# EAGLE schematic MPC_IR_Blaster (EAGLE 5.11)
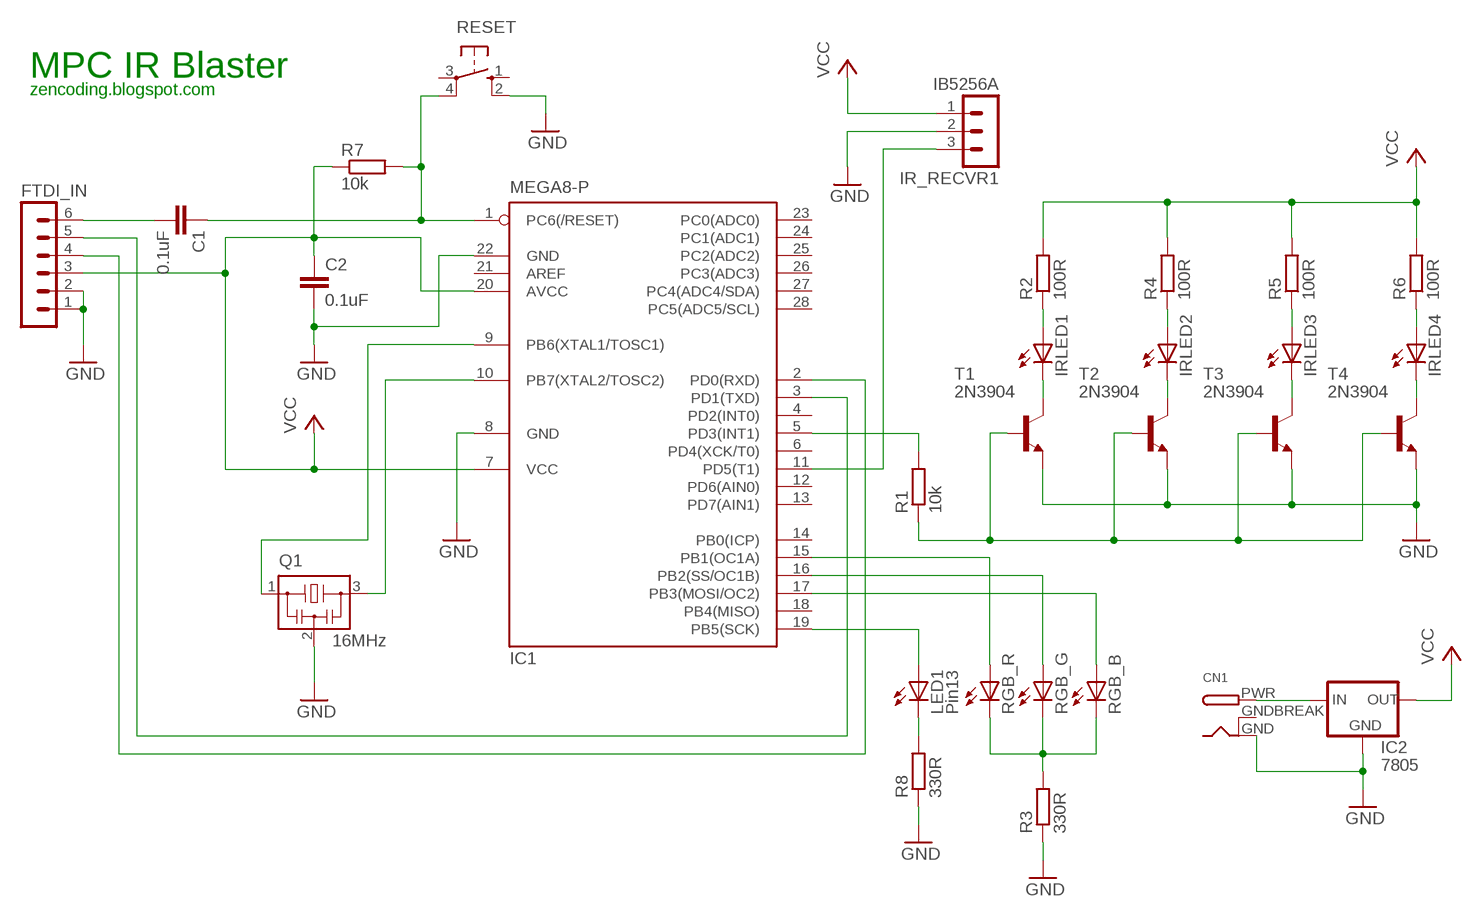
[diagram p0: schematic, sheet 1]

## Parts
C1  0.1uF  C-EU025-025X050  [C025-025X050]
C2  0.1uF  C-EU025-025X050  [C025-025X050]
CN1  DCBARRELPTH  [DCJACK_2MM_PTH]
FTDI_IN  MA06-1  [MA06-1]
IC1  MEGA8-P  [DIL28-3]
IC2  7805  78XXL  [78XXL]
IR_RECVR1  IB5256A  MA03-1  [MA03-1]
IRLED1  LED5MM  [LED5MM]
IRLED2  LED5MM  [LED5MM]
IRLED3  LED5MM  [LED5MM]
IRLED4  LED5MM  [LED5MM]
LED1  Pin13  LED3MM  [LED3MM]
Q1  16MHz  CSTCR6M00G53Z  [CSTCR6M]
R1  10k  R-EU_0204/5  [0204/5]
R2  100R  R-EU_0204/5  [0204/5]
R3  330R  R-EU_0204/5  [0204/5]
R4  100R  R-EU_0204/5  [0204/5]
R5  100R  R-EU_0204/5  [0204/5]
R6  100R  R-EU_0204/5  [0204/5]
R7  10k  R-EU_0204/5  [0204/5]
R8  330R  R-EU_0204/5  [0204/5]
RESET  10-XX  [B3F-10XX]
RGB_B  LED5MM  [LED5MM]
RGB_G  LED5MM  [LED5MM]
RGB_R  LED5MM  [LED5MM]
T1  2N3904  [TO92]
T2  2N3904  [TO92]
T3  2N3904  [TO92]
T4  2N3904  [TO92]

## Nets
DIGI_10: C1.1 IC1.1(PC6(/RESET)) R7.2 RESET.4(P1)
GND: C2.2 CN1.GND FTDI_IN.1 FTDI_IN.2 IC1.8(GND) IC1.22(GND) IC2.GND IR_RECVR1.2 Q1.2 R3.1 R8.1 RESET.2(S1) T1.3(E) T2.3(E) T3.3(E) T4.3(E)
N$1: IRLED1.A R2.1
N$2: IRLED1.K(C) T1.1(C)
N$3: R1.1 T1.2(B) T2.2(B) T3.2(B) T4.2(B)
N$4: R3.2 RGB_B.K(C) RGB_G.K(C) RGB_R.K(C)
N$5: IRLED2.A R4.1
N$6: IRLED2.K(C) T2.1(C)
N$7: IRLED3.A R5.1
N$8: IRLED3.K(C) T3.1(C)
N$9: IRLED4.A R6.1
N$10: IRLED4.K(C) T4.1(C)
N$11: C1.2 FTDI_IN.6
N$12: IC1.10(PB7(XTAL2/TOSC2)) Q1.3
N$13: IC1.9(PB6(XTAL1/TOSC1)) Q1.1
N$14: FTDI_IN.4 IC1.2(PD0(RXD))
N$15: FTDI_IN.5 IC1.3(PD1(TXD))
N$16: IC1.19(PB5(SCK)) LED1.A
N$17: LED1.K(C) R8.2
N$18: IC1.15(PB1(OC1A)) RGB_R.A
N$19: CN1.PWR IC2.IN
PIN3: IC1.5(PD3(INT1)) R1.2
PIN5: IR_RECVR1.3
PIN10: RGB_G.A
PIN11: RGB_B.A
VCC: C2.1 FTDI_IN.3 IC1.7(VCC) IC1.20(AVCC) IC2.OUT IR_RECVR1.1 R2.2 R4.2 R5.2 R6.2 R7.1
Unconnected: IC1.4(PD2(INT0)) IC1.6(PD4(XCK/T0)) IC1.11(PD5(T1)) IC1.12(PD6(AIN0)) IC1.13(PD7(AIN1)) IC1.14(PB0(ICP)) IC1.16(PB2(SS/OC1B)) IC1.17(PB3(MOSI/OC2)) IC1.18(PB4(MISO)) IC1.21(AREF) IC1.23(PC0(ADC0)) IC1.24(PC1(ADC1)) IC1.25(PC2(ADC2)) IC1.26(PC3(ADC3)) IC1.27(PC4(ADC4/SDA)) IC1.28(PC5(ADC5/SCL)) RESET.1(S) RESET.3(P)

## Notes on the sheet
- MPC IR Blaster
- zencoding.blogspot.com

## Power pins joined to a net without a drawn wire
GNDBREAK: CN1.GNDBREAK

## Library data of the parts
C1 = rcl:C-EU: CAPACITOR, European symbol
C2 = resistor:C-EU: CAPACITOR, European symbol
CN1 = adafruit:DCBARREL: 2.0mm DC Barrel Jack DCJACK_2MM_PTH - Through Hole Jack (4UConnector: 05537)
FTDI_IN = con-lstb:MA06-1: PIN HEADER; OC_FARNELL: unknown; OC_NEWARK: unknown
IC1 = atmel:MEGA8-P: MICROCONTROLLER 8 Kbytes FLASH, 1 kbytes SRAM, 512 bytes EEPROM, USART, 4-channel 10 bit ADC, 2-channel 8 bit ADC Pin compatible with Atmega48, ATMega88, ATMega168 Source: avr.lbr; OC_FARNELL: unknown; OC_NEWARK: unknown
IC2 = v-reg:78XXL: VOLTAGE REGULATOR
IR_RECVR1 = con-lstb:MA03-1: PIN HEADER; OC_FARNELL: unknown; OC_NEWARK: unknown
IRLED1-IRLED4 LED1 RGB_B RGB_G RGB_R = led:LED: LED OSRAM: - CHIPLED LG R971, LG N971, LY N971, LG Q971, LY Q971, LO R971, LY R971 LH N974, LH R974 LS Q976, LO Q976, LY Q976 LO Q996 - Hyper CHIPLED LW Q18S LB Q993, LB Q99A, LB R99A - SideLED LS A670, LO A670, LY A670, LG A670, LP A670 LB A673, LV A673, LT A673, LW A673 LH A674 LY A675 LS A676, LA A676, LO A676, LY A676, LW A676 LS A679, LY A679, LG A679 - Hyper Micro SIDELED® LS Y876, LA Y876, LO Y876, LY Y876 LT Y87S - SmartLED LW L88C, LW L88S LB L89C, LB L89S, LG L890 LS L89K, LO L89K, LY L89K LS L896, LA L896, LO L896, LY L896 - TOPLED LS T670, LO T670, LY T670, LG T670, LP T670 LSG T670, LSP T670, LSY T670, LOP T670, LYG T670 LG T671, LOG T671, LSG T671 LB T673, LV T673, LT T673, LW T673 LH T674 LS T676, LA T676, LO T676, LY T676, LB T676, LH T676, LSB T676, LW T676 LB T67C, LV T67C, LT T67C, LS T67K, LO T67K, LY T67K, LW E67C LS E67B, LA E67B, LO E67B, LY E67B, LB E67C, LV E67C, LT E67C LW T67C LS T679, LY T679, LG T679 LS T770, LO T770, LY T770, LG T770, LP T770 LB T773, LV T773, LT T773, LW T773 LH T774 LS E675, LA E675, LY E675, LS T675 LS T776, LA T776, LO T776, LY T776, LB T776 LHGB T686 LT T68C, LB T68C - Hyper Mini TOPLED® LB M676 - Mini TOPLED Santana® LG M470 LS M47K, LO M47K, LY M47K Source: http://www.osram.convergy.de LUXEON: - LUMILED® LXK2-PW12-R00, LXK2-PW12-S00, LXK2-PW14-U00, LXK2-PW14-V00 LXK2-PM12-R00, LXK2-PM12-S00, LXK2-PM14-U00 LXK2-PE12-Q00, LXK2-PE12-R00, LXK2-PE12-S00, LXK2-PE14-T00, LXK2-PE14-U00 LXK2-PB12-K00, LXK2-PB12-L00, LXK2-PB12-M00, LXK2-PB14-N00, LXK2-PB14-P00, LXK2-PB14-Q00 LXK2-PR12-L00, LXK2-PR12-M00, LXK2-PR14-Q00, LXK2-PR14-R00 LXK2-PD12-Q00, LXK2-PD12-R00, LXK2-PD12-S00 LXK2-PH12-R00, LXK2-PH12-S00 LXK2-PL12-P00, LXK2-PL12-Q00, LXK2-PL12-R00 Source: www.luxeon.com KINGBRIGHT: KA-3528ASYC Source: www.kingbright.com
Q1 = murata-filter:CSTCR: Resonator Source: murata.co.jp; MPN: CSTCR6M00G53-R0; OC_FARNELL: 1170434; OC_NEWARK: 25M8759
R1-R7 = resistor:R-EU_: RESISTOR, European symbol
R8 = rcl:R-EU_: RESISTOR, European symbol
RESET = switch-omron:10-XX: OMRON SWITCH; MPN: B3F-1000; OC_FARNELL: 176432; OC_NEWARK: 36M3542
T1-T4 = transistor:2N3904: NPN TRANSISTOR